# Altium schematic sheet 定位系统.SchDoc
size A3
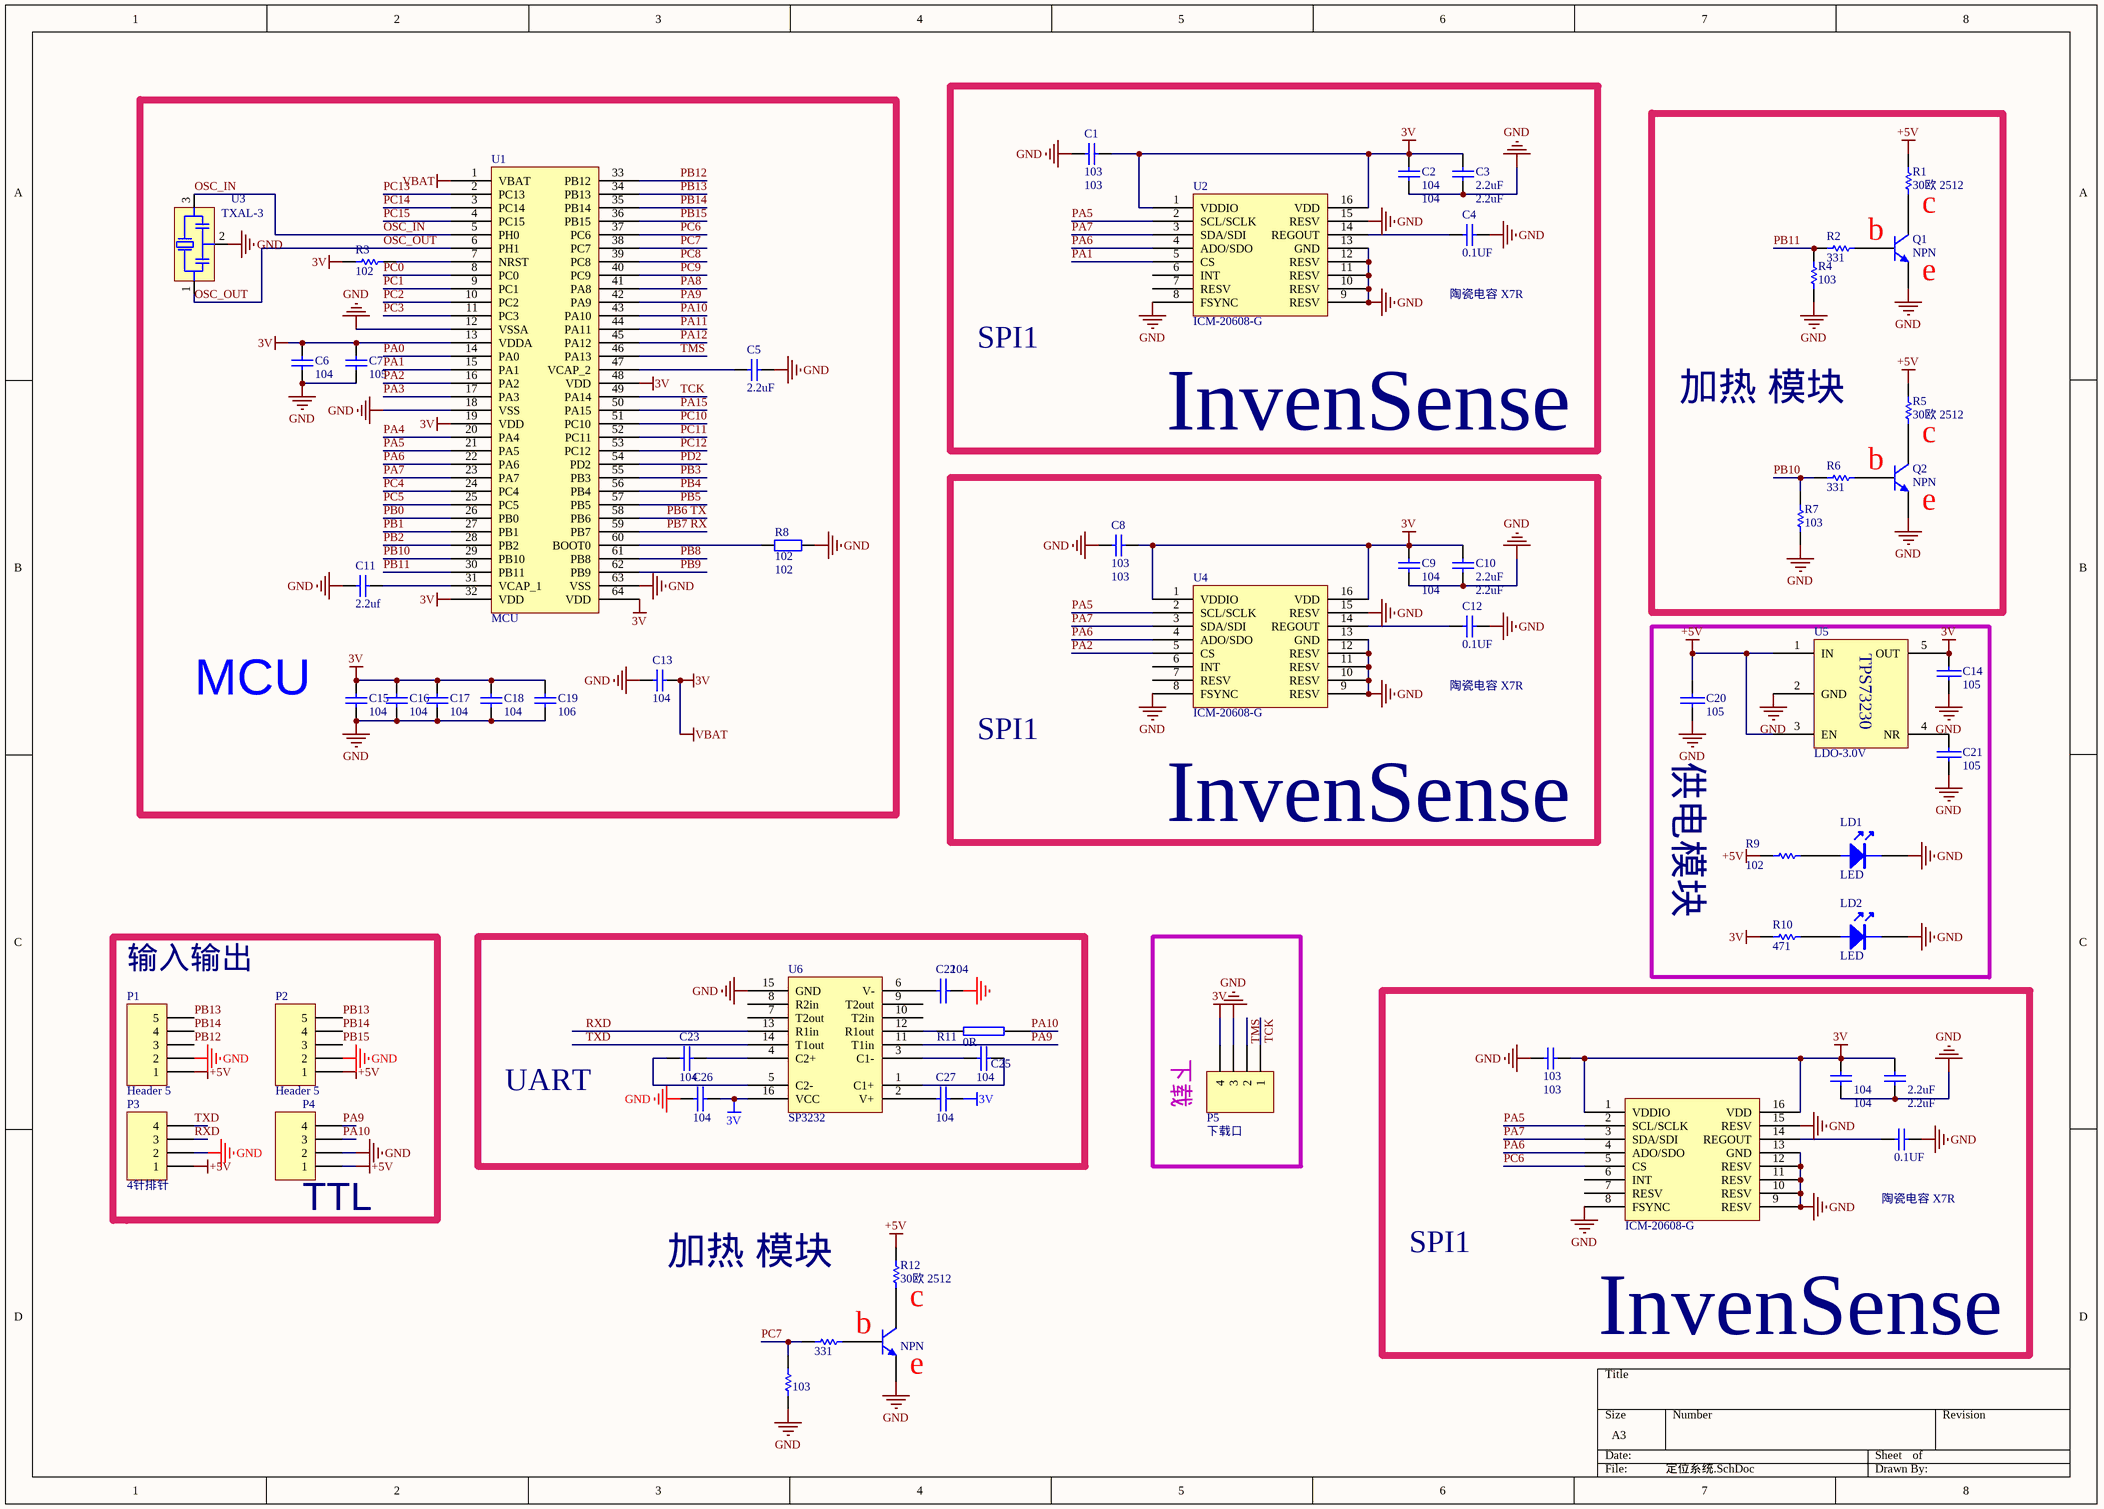
[diagram p0: 定位系统.SchDoc]

## Parts
(Parts that share a designator on the sheet are numbered #1, #2 ... from top to bottom, then left to right.)
?#1  103  [C-0603C]
?#2  104  [C-0603C]
?#3  2.2uF  [C-0603C]
?#4  0.1UF  [C-0603C]
?#5  ICM-20608-G  [ICM-20608-G]
?#6  331  [R-0603R]
?#7  NPN  [sot-23]
?#8  103  [R-0603R]
C1  103  [C-0603C]
C2  104  [C-0603C]
C3  2.2uF  [C-0603C]
C4  0.1UF  [C-0603C]
C5  2.2uF  [C-0603C]
C6  104  [C-0603C]
C7  105  [C-0603C]
C8  103  [C-0603C]
C9  104  [C-0603C]
C10  2.2uF  [C-0603C]
C11  2.2uf  [C-0603C]
C12  0.1UF  [C-0603C]
C13  104  [C-0603C]
C14  105  [C-0603C]
C15  104  [C-0603C]
C16  104  [C-0603C]
C17  104  [C-0603C]
C18  104  [C-0603C]
C19  106  [C-0603C]
C20  105  [C-0603C]
C21  105  [C-0603C]
C22  104  [C-0603C]
C23  104  [C-0603C]
C25  104  [C-0603C]
C26  104  [C-0603C]
C27  104  [C-0603C]
LD1  LED  [D-0805D]
LD2  LED  [D-0805D]
P1  Header 5  [FPC5-1.0]
P2  Header 5  [FPC5-1.0]
P3  4针排针  [4p-white]
P4  4针排针  [DOWMNPAD_S]  (value not drawn)
P5  下载口  [DOWMNPAD_S]
Q1  NPN  [sot-23]
Q2  NPN  [sot-23]
R1  30欧 2512  [SAMPLE-R]
R2  331  [R-0603R]
R3  102  [R-0603R]
R4  103  [R-0603R]
R5  30欧 2512  [SAMPLE-R]
R6  331  [R-0603R]
R7  103  [R-0603R]
R8  102  [R-0603R]
R9  102  [R-0603R]
R10  471  [R-0603R]
R11  0R  [R-0603R]
R12  30欧 2512  [SAMPLE-R]
U1  MCU  [LQFP64-STM32F405RG]
U2  ICM-20608-G  [ICM-20608-G]
U3  TXAL-3  [8M贴片晶振]
U4  ICM-20608-G  [ICM-20608-G]
U5  LDO-3.0V  [SOT95P280X145-5N]
U6  SP3232  [TSSOP-16]

## Blocks framed on the sheet
MCU: C5-C7 C11 C13 C15-C19 R3 R8 U1 U3
InvenSense: C1-C4 U2
加热 模块: Q1 Q2 R1 R2 R4-R7
InvenSense: C8-C10 C12 U4
供电模块: C14 C20 C21 LD1 LD2 R9 R10 U5
UART: C22 C23 C25-C27 R11 U6
下载: P5
InvenSense: ?#1-?#5

## Nets
3V: ?#1.1 ?#2.2 ?#3.2 ?#5.1(VDDIO) ?#5.16(VDD) C1.1 C2.2 C3.2 C6.1 C7.1 C8.1 C9.2 C10.2 C13.1 C14.1 C15.1 C16.1 C17.1 C18.1 C19.1 C26.1 C27.1 P5.4 R3.2 R10.1 U1.1(VBAT) U1.13(VDDA) U1.19(VDD) U1.32(VDD) U1.48(VDD) U1.64(VDD) U2.1(VDDIO) U2.16(VDD) U4.1(VDDIO) U4.16(VDD) U5.5(OUT) U6.16(VCC)  [also labelled VBAT]
+5V: C20.1 P1.1 P2.1 P3.1 P4.1 R1.2 R5.2 R9.1 R12.2 U5.1(IN) U5.3(EN)
GND: ?#1.2 ?#2.1 ?#3.1 ?#4.1 ?#5.8(FSYNC) ?#5.9(RESV) ?#5.10(RESV) ?#5.11(RESV) ?#5.12(RESV) ?#5.13(GND) ?#5.15(RESV) ?#7.3(E) ?#8.1 C1.2 C2.1 C3.1 C4.1 C5.2 C6.2 C7.2 C8.2 C9.1 C10.1 C11.1 C12.1 C13.2 C14.2 C15.2 C16.2 C17.2 C18.2 C19.2 C20.2 C21.2 C22.2 C26.2 LD1.K LD2.K P1.2 P2.2 P3.2 P4.2 P5.3 Q1.3(E) Q2.3(E) R4.1 R7.1 R8.2 U1.12(VSSA) U1.18(VSS) U1.63(VSS) U2.8(FSYNC) U2.9(RESV) U2.10(RESV) U2.11(RESV) U2.12(RESV) U2.13(GND) U2.15(RESV) U3.2(GND) U4.8(FSYNC) U4.9(RESV) U4.10(RESV) U4.11(RESV) U4.12(RESV) U4.13(GND) U4.15(RESV) U5.2(GND) U6.15(GND)
OSC_IN: U1.5(PH0) U3.3(OSCOUT)
OSC_OUT: U1.6(PH1) U3.1(OSCIN)
PA0: U1.14(PA0)
PA1: U1.15(PA1) U2.5(CS)
PA2: U1.16(PA2) U4.5(CS)
PA3: U1.17(PA3)
PA4: U1.20(PA4)
PA5: ?#5.2(SCL/SCLK) U1.21(PA5) U2.2(SCL/SCLK) U4.2(SCL/SCLK)
PA6: ?#5.4(ADO/SDO) U1.22(PA6) U2.4(ADO/SDO) U4.4(ADO/SDO)
PA7: ?#5.3(SDA/SDI) U1.23(PA7) U2.3(SDA/SDI) U4.3(SDA/SDI)
PA8: U1.41(PA8)
PA9: P4.4 U1.42(PA9) U6.11(T1in)
PA10: P4.3 R11.2 U1.43(PA10)
PA11: U1.44(PA11)
PA12: U1.45(PA12)
PA15: U1.50(PA15)
PB0: U1.26(PB0)
PB1: U1.27(PB1)
PB2: U1.28(PB2)
PB3: U1.55(PB3)
PB4: U1.56(PB4)
PB5: U1.57(PB5)
PB6 TX: U1.58(PB6)
PB7 RX: U1.59(PB7)
PB8: U1.61(PB8)
PB9: U1.62(PB9)
PB10: R6.1 R7.2 U1.29(PB10)
PB11: R2.1 R4.2 U1.30(PB11)
PB12: P1.3 U1.33(PB12)
PB13: P1.5 P2.5 U1.34(PB13)
PB14: P1.4 P2.4 U1.35(PB14)
PB15: P2.3 U1.36(PB15)
PC0: U1.8(PC0)
PC1: U1.9(PC1)
PC2: U1.10(PC2)
PC3: U1.11(PC3)
PC4: U1.24(PC4)
PC5: U1.25(PC5)
PC6: ?#5.5(CS) U1.37(PC6)
PC7: ?#6.1 ?#8.2 U1.38(PC7)
PC8: U1.39(PC8)
PC9: U1.40(PC9)
PC10: U1.51(PC10)
PC11: U1.52(PC11)
PC12: U1.53(PC12)
PC13: U1.2(PC13)
PC14: U1.3(PC14)
PC15: U1.4(PC15)
PD2: U1.54(PD2)
RXD: P3.3 U6.13(R1in)
TCK: P5.1 U1.49(PA14)
TMS: P5.2 U1.46(PA13)
TXD: P3.4 U6.14(T1out)
Net?#4_2: ?#4.2 ?#5.14(REGOUT)
Net?#6_2: ?#6.2 ?#7.2(B)
Net?#7_1: ?#7.1(C) R12.1
NetC4_2: C4.2 U2.14(REGOUT)
NetC5_1: C5.1 U1.47(VCAP_2)
NetC11_2: C11.2 U1.31(VCAP_1)
NetC12_2: C12.2 U4.14(REGOUT)
NetC21_1: C21.1 U5.4(NR)
NetC22_1: C22.1 U6.6(V-)
NetC23_1: C23.1 U6.4(C2+)
NetC23_2: C23.2 U6.5(C2-)
NetC25_1: C25.1 U6.1(C1+)
NetC25_2: C25.2 U6.3(C1-)
NetC27_2: C27.2 U6.2(V+)
NetLD1_A: LD1.A R9.2
NetLD2_A: LD2.A R10.2
NetQ1_1: Q1.1(C) R1.1
NetQ1_2: Q1.2(B) R2.2
NetQ2_1: Q2.1(C) R5.1
NetQ2_2: Q2.2(B) R6.2
NetR3_1: R3.1 U1.7(NRST)
NetR8_1: R8.1 U1.60(BOOT0)
NetR11_1: R11.1 U6.12(R1out)

Not connected (* = marked no-connect by the designer): ?#5 6(INT) 7(RESV); U2 6(INT) 7(RESV); U4 6(INT) 7(RESV); U6 7(T2out) 8(R2in) 9(T2out) 10(T2in)

## Notes on the sheet
- b
- c
- 陶瓷电容 X7R
- (near Q1) e
- SPI1
- (near Q2) e
- (near P1) 输入输出
- (near P4) TTL
- 加热 模块
- (near R12) c
- (near R12) b
- e
- (in symbol TPS73230MDBVREP) TPS73230

## Library data of the parts
?#1-?#4 C1-C3 C5-C13 C15-C19 = Cap: Capacitor; Published: 8-Jun-2000; LatestRevisionDate: 17-Jul-2002; LatestRevisionNote: Re-released for DXP Platform.; PackageReference: RAD-0.3; Publisher: Altium Limited
  ?#1 C1 C8: Value: 103
  ?#2 C2 C6 C9 C13 C15-C18: Value: 104
  ?#3 C3 C5 C10: Value: 2.2uF
  C7: Value: 105
  C11: Value: 2.2uf
  C19: Value: 106
?#6 ?#8 R1-R7 R9 R10 R12 = Res Semi: Semiconductor Resistor; Published: 8-Jun-2000; LatestRevisionDate: 17-Jul-2002; LatestRevisionNote: Re-released for DXP Platform.; PackageReference: AXIAL-0.5; Publisher: Altium Limited; PackageDescription: Axial Device, Thru-Hole; 2 Leads; 0.5 in Pin Spacing
  ?#6 R2 R6: Value: 331
  ?#8 R4 R7: Value: 103
  R1 R5 R12: Value: 30欧 2512
  R3 R9: Value: 102
  R10: Value: 471
?#7 Q1 Q2 = NPN: NPN Bipolar Transistor; pin to pad: 1>3 2>1 3>2; Published: 8-Jun-2000; LatestRevisionDate: 17-Jul-2002; LatestRevisionNote: Re-released for DXP Platform.; PackageReference: TO-226; Publisher: Altium Limited; Code_JEDEC: TO-226-AA
C4 = Cap: Capacitor; Value: 0.47uF; Published: 8-Jun-2000; LatestRevisionDate: 17-Jul-2002; LatestRevisionNote: Re-released for DXP Platform.; PackageReference: RAD-0.3; Publisher: Altium Limited
C14 C20-C23 C25-C27 = CAP: Capacitor
P1 P2 = Header 5: Header, 5-Pin; LatestRevisionDate: 17-Jul-2002; LatestRevisionNote: Re-released for DXP Platform.; Publisher: Altium Limited
P3-P5 = Header 4: Header, 4-Pin; LatestRevisionDate: 17-Jul-2002; LatestRevisionNote: Re-released for DXP Platform.; Publisher: Altium Limited
R8 = Res2: Resistor; Published: 8-Jun-2000; LatestRevisionDate: 17-Jul-2002; LatestRevisionNote: Re-released for DXP Platform.; PackageReference: AXIAL-0.4; Publisher: Altium Limited; Value: 102
R11 = RES2
U1 = STM32F405RGT7
U5 = TPS73230MDBVREP
U6 = Component_1